# Altium project charcer-wiht-stm32.PrjPcb
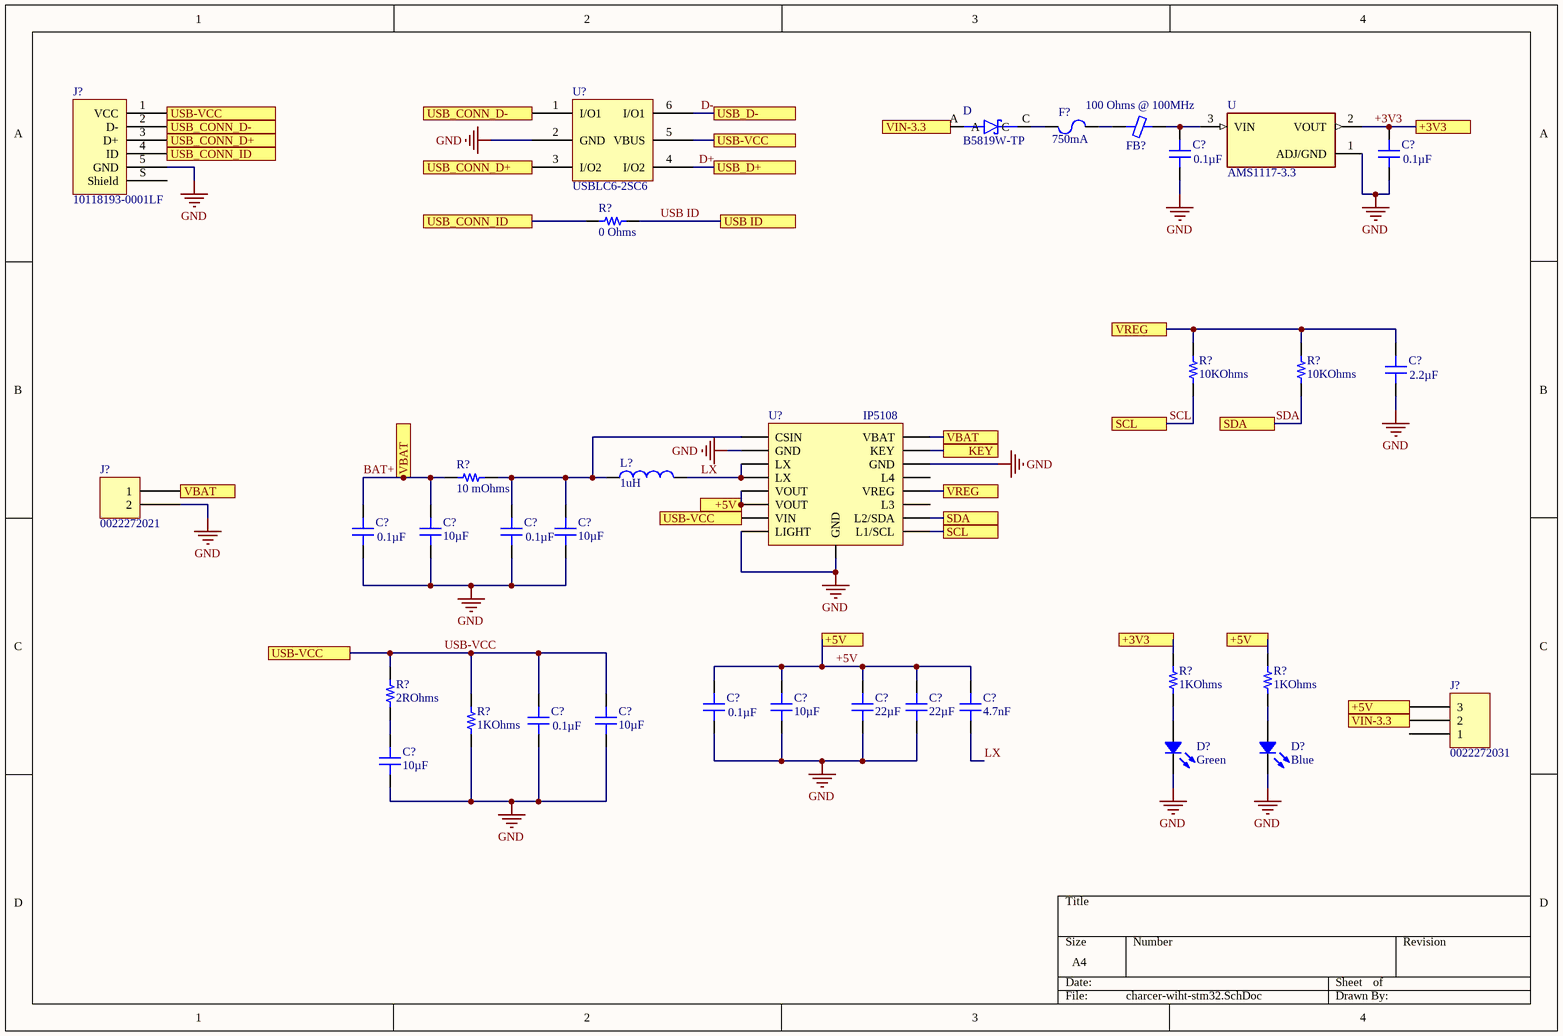
[diagram p0: charcer-wiht-stm32.SchDoc]
3 sheets, 63 parts. Net scope: flat (ports and power ports of the same name join across sheets).
Board file: charcer-wiht-stm32.PcbDoc
Sheets:
  charcer-wiht-stm32.SchDoc
  stm side.SchDoc
  ESP32-WROOM-32D.SchDoc

## Sheet charcer-wiht-stm32.SchDoc
size A4

### Parts
(Parts that share a designator on the sheet are numbered #1, #2 ... from top to bottom, then left to right.)
C?#1  0.1µF  [CAP 0805_2012]
C?#2  0.1µF  [CAP 0805_2012]
C?#3  2.2µF  [CAP 0805_2012]
C?#4  0.1µF  [CAP 0805_2012]
C?#5  10µF  [CAP 0805_2012]
C?#6  0.1µF  [CAP 0805_2012]
C?#7  10µF  [CAP 0805_2012]
C?#8  0.1µF  [CAP 0805_2012]
C?#9  10µF  [CAP 0805_2012]
C?#10  22µF  [CAP 1206_3216 - 1.8MM]
C?#11  22µF  [CAP 1206_3216 - 1.8MM]
C?#12  4.7nF  [CAP 0805_2012]
C?#13  0.1µF  [CAP 0805_2012]
C?#14  10µF  [CAP 0805_2012]
C?#15  10µF  [CAP 0805_2012]
D  B5819W-TP  [SOD3716X135N]
D?#1  Green  [LED 0805_2012 GREEN]
D?#2  Blue  [LED 0805_2012 BLUE]
F?  750mA  [FUSE 1206_3216 0.6MM]
FB?#1  100 Ohms @ 100MHz  [FER 0805_2012]
J?#1  10118193-0001LF  [FCI USB 10118193-0001LF]
J?#2  0022272021  [MOLEX KK 0022272021]
J?#3  0022272031  [MOLEX KK 0022272031]
L?  1uH  [INDM7666X50N]
R?#1  0 Ohms  [RES 0402_1005]
R?#2  10KOhms  [RES 0805_2012]
R?#3  10KOhms  [RES 0805_2012]
R?#4  10 mOhms  [RES 0805_2012]
R?#5  1KOhms  [RES 0805_2012]
R?#6  1KOhms  [RES 0805_2012]
R?#7  2ROhms  [RES 0805_2012]
R?#8  1KOhms  [RES 0805_2012]
U  AMS1117-3.3  [SOT229P700X180-4N]
U?#1  USBLC6-2SC6  [SOT23-6L]
U?#2  IP5108  [SOP-16_150mil]

### Ports
+3V3, +5V, KEY, SCL, SDA, USB ID, USB-VCC, USB_CONN_D+, USB_CONN_D-, USB_CONN_ID, USB_D+, USB_D-, VBAT, VIN-3.3, VREG

### Nets
GND: C?#1.1 C?#2.1 C?#3.1 C?#4.1 C?#5.1 C?#6.1 C?#7.1 C?#8.1 C?#9.1 C?#10.1 C?#11.1 C?#13.1 C?#14.1 C?#15.1 D?#1.2 D?#2.2 J?#1.5(GND) J?#2.2 R?#8.2 U.1(ADJ/GND) U?#1.2(GND) U?#2.2(GND) U?#2.8(LIGHT) U?#2.14(GND) U?#2.17(GND)
+3V3: C?#2.2 R?#5.1 U.2(VOUT) ; port +3V3
+5V: C?#8.2 C?#9.2 C?#10.2 C?#11.2 C?#12.2 J?#3.3 R?#6.1 U?#2.5(VOUT) U?#2.6(VOUT) ; port +5V
BAT+: C?#4.2 C?#5.2 J?#2.1 R?#4.1 U?#2.16(VBAT) ; port VBAT
D+: U?#1.4(I/O2) ; port USB_D+
D-: U?#1.6(I/O1) ; port USB_D-
LX: C?#12.1 L?.1 U?#2.3(LX) U?#2.4(LX)
SCL: R?#2.2 U?#2.9(L1/SCL) ; port SCL
SDA: R?#3.2 U?#2.10(L2/SDA) ; port SDA
USB ID: R?#1.2 ; port USB ID
USB-VCC: C?#13.2 C?#14.2 J?#1.1(VCC) R?#7.1 R?#8.1 U?#1.5(VBUS) U?#2.7(VIN) ; port USB-VCC
NetC?#1_2: C?#1.2 FB?#1.2 U.3(VIN)
NetC?#3_2: C?#3.2 R?#2.1 R?#3.1 U?#2.12(VREG) ; port VREG
NetC?#6_2: C?#6.2 C?#7.2 L?.2 R?#4.2 U?#2.1(CSIN)
NetC?#15_2: C?#15.2 R?#7.2
NetD?#1_1: D?#1.1 R?#5.2
NetD?#2_1: D?#2.1 R?#6.2
NetD_A: D.A J?#3.2 ; port VIN-3.3
NetD_C: D.C F?.1
NetF?_2: F?.2 FB?#1.1
NetJ?#1_2: J?#1.2(D-) U?#1.1(I/O1) ; port USB_CONN_D-
NetJ?#1_3: J?#1.3(D+) U?#1.3(I/O2) ; port USB_CONN_D+
NetJ?#1_4: J?#1.4(ID) R?#1.1 ; port USB_CONN_ID
NetU?#2_15: U?#2.15(KEY) ; port KEY

Not connected (* = marked no-connect by the designer): J?#1 S(Shield); J?#3 1; U?#2 11(L3) 13(L4)

### Library data of the parts
C?#1 C?#2 C?#4 C?#6 C?#8 C?#13 = VJ0805Y104KFAAT: CAP CER 0.1UF 50V X7R 0805; Manufacturer: Vishay Vitramon; Tolerance: ±10%; Part Number: VJ0805Y104KFAAT; Value: 0.1µF; Applications: General Purpose; Capacitance: 0.1µF; ComponentLink1Description: Datasheet; ComponentLink1URL: http://www.vishay.com/docs/45199/vjcommercialseries.pdf; ComponentLink2Description: DigiKey Link; ComponentLink2URL: http://digikey.com/product-detail/en/vishay-vitramon/VJ0805Y104KFAAT/720-1753-1-ND/8324173; Device Package: 0805 (2012 Metric); LastUpdated: 2.9.2020 01:04:40; Lifecycle Status: Active; Minimum Order: 1; Mounting Type: Surface Mount, MLCC; Operating Temperature: -55°C ~ 150°C; Package / Case: 0805 (2012 Metric); Packaging: TapeAndReel; PartId: 3420; Part Status: Active; Price: 0.18; Series: VJ; Size / Dimension: 0.079" L x 0.049" W (2.00mm x 1.25mm); Supplier 1: DigiKey; Supplier Part Number 1: 720-1753-1-ND; Temperature Coefficient: X7R; Thickness (Max): 0.057" (1.45mm); Voltage - Rated: 50V
C?#3 = VJ0805Y104KFAAT: CAP CER 0.1UF 50V X7R 0805; Manufacturer: Vishay Vitramon; Capacitance: 0.1µF; Tolerance: ±10%; Part Number: VJ0805Y104KFAAT; Value: 2.2µF; Applications: General Purpose; ComponentLink1Description: Datasheet; ComponentLink1URL: http://www.vishay.com/docs/45199/vjcommercialseries.pdf; ComponentLink2Description: DigiKey Link; ComponentLink2URL: http://digikey.com/product-detail/en/vishay-vitramon/VJ0805Y104KFAAT/720-1753-1-ND/8324173; Device Package: 0805 (2012 Metric); LastUpdated: 2.9.2020 01:04:40; Lifecycle Status: Active; Minimum Order: 1; Mounting Type: Surface Mount, MLCC; Operating Temperature: -55°C ~ 150°C; Package / Case: 0805 (2012 Metric); Packaging: TapeAndReel; PartId: 3420; Part Status: Active; Price: 0.18; Series: VJ; Size / Dimension: 0.079" L x 0.049" W (2.00mm x 1.25mm); Supplier 1: DigiKey; Supplier Part Number 1: 720-1753-1-ND; Temperature Coefficient: X7R; Thickness (Max): 0.057" (1.45mm); Voltage - Rated: 50V
C?#5 C?#7 C?#9 C?#14 C?#15 = CL21X106KAYNNNE: CAP CER 10UF 25V X6S 0805; Manufacturer: Samsung Electro-Mechanics; Tolerance: ±10%; Part Number: CL21X106KAYNNNE; Value: 10µF; Applications: General Purpose; Capacitance: 10µF; ComponentLink1Description: Datasheet; ComponentLink1URL: http://www.samsungsem.com/kr/support/product-search/mlcc/CL21X106KAYNNNE.jsp; ComponentLink2Description: DigiKey Link; ComponentLink2URL: http://digikey.com/product-detail/en/samsung-electro-mechanics/CL21X106KAYNNNE/1276-6698-1-ND/5961557; Device Package: 0805 (2012 Metric); LastUpdated: 2.9.2020 01:04:38; Lifecycle Status: Active; Minimum Order: 1; Mounting Type: Surface Mount, MLCC; Operating Temperature: -55°C ~ 105°C; Package / Case: 0805 (2012 Metric); Packaging: TapeAndReel; PartId: 4781; Part Status: Active; Price: 0.06; Series: CL; Size / Dimension: 0.079" L x 0.049" W (2.00mm x 1.25mm); Supplier 1: DigiKey; Supplier Part Number 1: 1276-6698-1-ND; Temperature Coefficient: X6S; Thickness (Max): 0.057" (1.45mm); Voltage - Rated: 25V
C?#10 C?#11 = EMK316ABJ226KL-T: CAP CER 22UF 16V X5R 1206; Manufacturer: Taiyo Yuden; Tolerance: ±10%; Part Number: EMK316ABJ226KL-T; Value: 22µF; Applications: General Purpose; Capacitance: 22µF; ComponentLink1Description: Datasheet; ComponentLink1URL: https://www.yuden.co.jp/productdata/catalog/mlcc01_e.pdf; ComponentLink2Description: DigiKey Link; ComponentLink2URL: http://digikey.com/product-detail/en/taiyo-yuden/EMK316ABJ226KL-T/587-5521-1-ND/7067197; Device Package: 1206 (3216 Metric); LastUpdated: 2.9.2020 01:05:31; Lifecycle Status: Active; Minimum Order: 1; Mounting Type: Surface Mount, MLCC; Operating Temperature: -55°C ~ 85°C; Package / Case: 1206 (3216 Metric); Packaging: TapeAndReel; PartId: 21826; Part Status: Active; Price: 0.11; Series: M; Size / Dimension: 0.126" L x 0.063" W (3.20mm x 1.60mm); Supplier 1: DigiKey; Supplier Part Number 1: 587-5521-1-ND; Temperature Coefficient: X5R; Thickness (Max): 0.071" (1.80mm); Voltage - Rated: 16V
C?#12 = CL21X106KAYNNNE: CAP CER 10UF 25V X6S 0805; Manufacturer: Samsung Electro-Mechanics; Capacitance: 10µF; Tolerance: ±10%; Part Number: CL21X106KAYNNNE; Value: 4.7nF; Applications: General Purpose; ComponentLink1Description: Datasheet; ComponentLink1URL: http://www.samsungsem.com/kr/support/product-search/mlcc/CL21X106KAYNNNE.jsp; ComponentLink2Description: DigiKey Link; ComponentLink2URL: http://digikey.com/product-detail/en/samsung-electro-mechanics/CL21X106KAYNNNE/1276-6698-1-ND/5961557; Device Package: 0805 (2012 Metric); LastUpdated: 2.9.2020 01:04:38; Lifecycle Status: Active; Minimum Order: 1; Mounting Type: Surface Mount, MLCC; Operating Temperature: -55°C ~ 105°C; Package / Case: 0805 (2012 Metric); Packaging: TapeAndReel; PartId: 4781; Part Status: Active; Price: 0.06; Series: CL; Size / Dimension: 0.079" L x 0.049" W (2.00mm x 1.25mm); Supplier 1: DigiKey; Supplier Part Number 1: 1276-6698-1-ND; Temperature Coefficient: X6S; Thickness (Max): 0.057" (1.45mm); Voltage - Rated: 25V
D = B5819W-TP: Diode Schottky 20V 1A Surface Mount SOD-123; MF: Micro Commercial; Value: *; MP: B5819W-TP; SnapEDA_Link: https://www.snapeda.com/parts/B5819W-TP/Micro%20Commercial/view-part/214542/?ref=snap; Availability: Unavailable; Package: SOD-123 MCC; Price: None
D?#1 = SM0805UGC: LED GREEN CLEAR 0805 SMD; Manufacturer: Bivar Inc.; Configuration: Standard; Current - Test: 20mA; Lens Color: Colorless; Lens Size: 1.40mm x 1.20mm; Lens Style: Rectangle with Flat Top; Millicandela Rating: 10mcd; Viewing Angle: 130°; Voltage - Forward (Vf) (Typ): 2V; Wavelength - Dominant: 565nm; Wavelength - Peak: 563nm; Part Number: SM0805UGC; Color: Green; ComponentLink1Description: Datasheet; ComponentLink1URL: https://www.bivar.com/Files/Datasheets/SM0805UGC.pdf; ComponentLink2Description: DigiKey Link; ComponentLink2URL: http://digikey.com/product-detail/en/bivar-inc/SM0805UGC/492-1329-1-ND/2408561; Device Package: 0805 (2012 Metric); Height (Max): 1.10mm; LastUpdated: 2.9.2020 01:21:05; Lens Transparency: Clear; Lifecycle Status: Active; Minimum Order: 1; Mounting Type: Surface Mount; Package / Case: 0805 (2012 Metric); Packaging: TapeAndReel; PartId: 247; Part Status: Active; Price: 0.18; Series: -; Size / Dimension: 2.00mm L x 1.20mm W; Supplier 1: DigiKey; Supplier Part Number 1: 492-1329-1-ND; Supplier Device Package: 0805; Value: Green
D?#2 = HSMN-C170: LED BLUE DIFFUSED CHIP SMD; Manufacturer: Broadcom Limited; Configuration: Standard; Current - Test: 20mA; Lens Color: White; Lens Size: 1.40mm x 1.25mm; Lens Style: Rectangle with Flat Top; Millicandela Rating: 35mcd; Viewing Angle: 170°; Voltage - Forward (Vf) (Typ): 3.3V; Wavelength - Dominant: 470nm; Wavelength - Peak: 468nm; Part Number: HSMN-C170; Color: Blue; ComponentLink1Description: Datasheet; ComponentLink1URL: https://docs.broadcom.com/docs/AV02-0592EN; ComponentLink2Description: DigiKey Link; ComponentLink2URL: http://digikey.com/product-detail/en/broadcom-limited/HSMN-C170/516-1437-1-ND/637761; Device Package: 0805 (2012 Metric); Height (Max): 0.80mm; LastUpdated: 2.9.2020 01:20:30; Lens Transparency: Diffused; Lifecycle Status: Active; Minimum Order: 1; Mounting Type: Surface Mount; Package / Case: 0805 (2012 Metric); Packaging: TapeAndReel; PartId: 770; Part Status: Active; Price: 0.28; Series: -; Size / Dimension: 2.00mm L x 1.25mm W; Supplier 1: DigiKey; Supplier Part Number 1: 516-1437-1-ND; Supplier Device Package: Chip LED; Value: Blue
F? = 3413.0114.22: FUSE BOARD MNT 750MA 32VAC 63VDC; Manufacturer: Schurter Inc.; Approval Agency: cURus; Breaking Capacity @ Rated Voltage: 50A; Fuse Type: Board Mount (Cartridge Style Excluded); Melting I²t: 0.05; Response Time: Fast Blow; Voltage Rating - AC: 32V; Voltage Rating - DC: 63V; Part Number: 3413.0114.22; Approvals: cURus; ComponentLink1Description: Datasheet; ComponentLink1URL: http://www.schurterinc.com/bundles/snceschurter/epim/_ProdPool_/newDS/en/typ_USF_1206.pdf; ComponentLink2Description: DigiKey Link; ComponentLink2URL: http://digikey.com/product-detail/en/schurter-inc/3413.0114.22/486-1676-1-ND/2870076; Current Rating (Amps): 750mA; Device Package: 1206 (3216 Metric); LastUpdated: 2.9.2020 01:30:41; Lifecycle Status: Active; Minimum Order: 1; Mounting Type: Surface Mount; Operating Temperature: -55°C ~ 90°C; Package / Case: 1206 (3216 Metric); Packaging: TapeAndReel; Part Status: Active; Price: 0.24; Series: USF 1206; Size / Dimension: 0.126" L x 0.063" W x 0.024" H (3.20mm x 1.60mm x 0.60mm); Supplier 1: DigiKey; Supplier Part Number 1: 486-1676-1-ND
FB?#1 = MH2029-101Y: FERRITE BEAD 100 OHM 0805 1LN; Manufacturer: Bourns Inc.; Current Rating (Max): 2A; DC Resistance (DCR) (Max): 100mOhm; Filter Type: Power, Signal Line; Number of Lines: 1; Part Number: MH2029-101Y; ComponentLink1Description: Datasheet; ComponentLink1URL: https://www.bourns.com/docs/Product-Datasheets/mh.pdf; ComponentLink2Description: DigiKey Link; ComponentLink2URL: http://digikey.com/product-detail/en/bourns-inc/MH2029-101Y/MH2029-101YCT-ND/6100092; Device Package: 0805 (2012 Metric); Height (Max): 0.043" (1.10mm); Impedance @ Frequency: 100 Ohms @ 100MHz; LastUpdated: 2.9.2020 01:18:23; Lifecycle Status: Active; Minimum Order: 1; Mounting Type: Surface Mount; Operating Temperature: -55°C ~ 125°C; Package / Case: 0805 (2012 Metric); Packaging: TapeAndReel; PartId: 1212; Part Status: Active; Price: 0.02; Series: MH; Size / Dimension: 0.079" L x 0.047" W (2.00mm x 1.20mm); Supplier 1: DigiKey; Supplier Part Number 1: MH2029-101YCT-ND; Value: 100 Ohms @ 100MHz
J?#1 = 10118193-0001LF: CONN RCPT USB2.0 MICRO B SMD R/A; Manufacturer: Amphenol ICC (FCI); Connector Type: USB - micro B; Current Rating (Amps): 1.8A per Contact; Gender: Receptacle; Mating Cycles: 10000; Number of Contacts: 5; Number of Ports: 1; Shielding: Shielded; Voltage - Rated: 100VAC; Part Number: 10118193-0001LF; ComponentLink1Description: Datasheet; ComponentLink1URL: https://cdn.amphenol-icc.com/media/wysiwyg/files/documentation/datasheet/inputoutput/io_usb_micro.pdf; ComponentLink2Description: DigiKey Link; ComponentLink2URL: //digikey.com/product-detail/en/amphenol-icc-fci/10118193-0001LF/609-4616-2-ND/2785388; Features: Solder Retention; LastUpdated: 9.12.2019 20:51:28; Lifecycle Status: 0; Minimum Order: 1; Mounting Feature: Horizontal; Mounting Type: Surface Mount, Right Angle; Through Hole; Operating Temperature: -30°C ~ 80°C; Packaging: TapeAndReel; Part Status: Active; Price: 0.21; Series: -; Specifications: USB 2.0; Supplier 1: DigiKey; Supplier Part Number 1: 609-4616-2-ND; Termination: Solder
J?#2 = 0022272021: CONN HEADER VERT 2POS 2.54MM; Manufacturer: Molex; Contact Length - Mating: 0.295" (7.49mm); Contact Length - Post: 0.140" (3.56mm); Material Flammability Rating: UL94 V-0; Number of Positions: 2; Number of Positions Loaded: All; Overall Contact Length: 0.560" (14.22mm); Pitch - Mating: 0.100" (2.54mm); Shrouding: Shrouded - 1 Wall; Style: Board to Cable/Wire; Part Number: 0022272021; ComponentLink1Description: Datasheet; ComponentLink1URL: https://www.molex.com/pdm_docs/sd/022272021_sd.pdf; ComponentLink2Description: DigiKey Link; ComponentLink2URL: http://digikey.com/product-detail/en/molex/0022272021/WM4111-ND/1130577; Connector Type: Header; Contact Finish - Mating: Tin; Contact Finish - Post: Tin; Contact Finish Thickness - Mating: 100.0µin (2.54µm); Contact Material: Brass; Contact Shape: Square; Contact Type: Male Pin; Fastening Type: Friction Lock; Insulation Color: Natural; Insulation Height: 0.461" (11.70mm); Insulation Material: Polyamide (PA), Nylon; LastUpdated: 12.1.2020 23:51:43; Lifecycle Status: Active; Minimum Order: 1; Mounting Type: Through Hole; Number of Rows: 1; Packaging: Bulk; PartId: 76; Part Status: Active; Price: 0.27; Series: KK 6410; Supplier 1: DigiKey; Supplier Part Number 1: WM4111-ND; Termination: Solder
J?#3 = 0022272031: CONN HEADER VERT 3POS 2.54MM; Manufacturer: Molex; Contact Length - Mating: 0.295" (7.49mm); Contact Length - Post: 0.140" (3.56mm); Material Flammability Rating: UL94 V-0; Number of Positions: 3; Number of Positions Loaded: All; Overall Contact Length: 0.560" (14.22mm); Pitch - Mating: 0.100" (2.54mm); Shrouding: Shrouded - 1 Wall; Style: Board to Cable/Wire; Part Number: 0022272031; ComponentLink1Description: Datasheet; ComponentLink1URL: https://www.molex.com/pdm_docs/sd/022272031_sd.pdf; ComponentLink2Description: DigiKey Link; ComponentLink2URL: http://digikey.com/product-detail/en/molex/0022272031/WM4112-ND/1130578; Connector Type: Header; Contact Finish - Mating: Tin; Contact Finish - Post: Tin; Contact Finish Thickness - Mating: 100.0µin (2.54µm); Contact Material: Brass; Contact Shape: Square; Contact Type: Male Pin; Fastening Type: Friction Lock; Insulation Color: Natural; Insulation Height: 0.461" (11.70mm); Insulation Material: Polyamide (PA), Nylon; LastUpdated: 12.1.2020 23:51:54; Lifecycle Status: Active; Minimum Order: 1; Mounting Type: Through Hole; Number of Rows: 1; Packaging: Bulk; PartId: 77; Part Status: Active; Price: 0.37; Series: KK 6410; Supplier 1: DigiKey; Supplier Part Number 1: WM4112-ND; Termination: Solder
L? = SMPI06050-1R0M: Fixed Inductors .1uH 20%; Manufacturer: CORE MASTER; Core Material: Ferrite; DC Resistance (DCR): 7mR; Shielding: Shielded; Inductance: 100nH; Max DC Current: 40A; Test Frequency: 100kHz; Current Rating: 18A; Self Resonant Frequency: 5MHz; Resistance: 3mR; Supplier 1: ozdisan; Manufacturer Part Number: SMPI06050-1R0M; RoHS: Yes; Category: Fixed Inductors; Mount: Surface Mount; Case/Package: NONSTANDARD; Number of Pins: 2; Case Code (Imperial): 2525; Case Code (Metric): 6363; Min Operating Temperature: -55°C; Max Operating Temperature: 125°C; Package Quantity: 2000; Packaging: Tape and Reel; Termination: SMD/SMT; Tolerance: 20%; Saturation Current: 40A; Inductance Tolerance: 20%; RMS Current (Irms): 18A; Length: 6.86mm; Width: 0.255inch; Height: 1.8mm; Height - Seated (Max): 0.071inch; Depth: 6.72mm; Radiation Hardening: No; Lead Free: Lead Free; REACH SVHC: Unknown; ComponentLink1URL: https://datasheet.ciiva.com/11798/0900766b8102c932-11798378.pdf?src-supplier=RSComponents; ComponentLink1Description: https://datasheet.ciiva.com/11798/0900766b8102c932-11798378.pdf?src-supplier=RSComponents; ComponentLink2URL: https://datasheet.ciiva.com/1076/ih25ah01-1076900.pdf?src-supplier=Digi-Key; ComponentLink2Description: https://datasheet.ciiva.com/1076/ih25ah01-1076900.pdf?src-supplier=Digi-Key; ComponentLink3URL: https://datasheet.ciiva.com/8017/425589-8017240.pdf?src-supplier=Element14; ComponentLink3Description: https://datasheet.ciiva.com/8017/425589-8017240.pdf?src-supplier=Element14; ComponentLink4URL: https://datasheet.ciiva.com/17269/ih25ah01-17269371.pdf?src-supplier=Avnet+Europe; ComponentLink4Description: https://datasheet.ciiva.com/17269/ih25ah01-17269371.pdf?src-supplier=Avnet+Europe; ComponentLink5URL: https://datasheet.ciiva.com/16460/ih25ah01-16460077.pdf?src-supplier=Future+Electronics; ComponentLink5Description: https://datasheet.ciiva.com/16460/ih25ah01-16460077.pdf?src-supplier=Future+Electronics; ComponentLink6URL: https://datasheet.ciiva.com/8496/ih25ah01-8496206.pdf?src-supplier=Avnet; ComponentLink6Description: https://datasheet.ciiva.com/8496/ih25ah01-8496206.pdf?src-supplier=Avnet; Stock 1: 2000; Supplier Part Number 1: SMPI06050-1R0M
R?#1 = CRCW04020000Z0EDHP: RES SMD 0 OHM JUMPER 1/5W 0402; Manufacturer: Vishay Dale; Power (Watts): 0.2W, 1/5W; Part Number: CRCW04020000Z0EDHP; Value: 0 Ohms; ComponentLink1Description: Datasheet; ComponentLink1URL: http://www.vishay.com/docs/20043/crcwhpe3.pdf; ComponentLink2Description: DigiKey Link; ComponentLink2URL: http://digikey.com/product-detail/en/vishay-dale/CRCW04020000Z0EDHP/541-0.0YBCT-ND/2223008; Composition: Thick Film; Device Package: 0402 (1005 Metric); Features: Automotive AEC-Q200, Pulse Withstanding; Height - Seated (Max): 0.016" (0.40mm); LastUpdated: 2.9.2020 01:08:09; Lifecycle Status: Active; Minimum Order: 1; Number of Terminations: 2; Operating Temperature: -55°C ~ 155°C; Package / Case: 0402 (1005 Metric); Packaging: TapeAndReel; PartId: 3131; Part Status: Active; Price: 0.01; Ratings: AEC-Q200; Resistance: 0 Ohms; Series: CRCW-HP; Size / Dimension: 0.039" L x 0.020" W (1.00mm x 0.50mm); Supplier 1: DigiKey; Supplier Part Number 1: 541-0.0YBCT-ND; Supplier Device Package: 0402; Tolerance: Jumper
R?#2 R?#3 R?#5-R?#8 = RL0805FR-070R01L: RES 0.01 OHM 1% 1/8W 0805; Manufacturer: Yageo; Power (Watts): 0.125W, 1/8W; Resistance: 10 mOhms; Temperature Coefficient: ±1500ppm/°C; Part Number: RL0805FR-070R01L; ComponentLink1Description: Datasheet; ComponentLink1URL: http://www.yageo.com/documents/recent/PYu-RL_Group_521_RoHS_L_2.pdf; ComponentLink2Description: DigiKey Link; ComponentLink2URL: http://digikey.com/product-detail/en/yageo/RL0805FR-070R01L/311-0.01SCT-ND/2827993; Composition: Thick Film; Device Package: 0805 (2012 Metric); Features: Automotive AEC-Q200, Current Sense, Moisture Resistant; Height - Seated (Max): 0.024" (0.60mm); LastUpdated: 2.9.2020 01:15:18; Lifecycle Status: Active; Minimum Order: 1; Number of Terminations: 2; Operating Temperature: -55°C ~ 155°C; Package / Case: 0805 (2012 Metric); Packaging: TapeAndReel; PartId: 30376; Part Status: Active; Price: 0.09; Ratings: AEC-Q200; Series: RL; Size / Dimension: 0.079" L x 0.049" W (2.00mm x 1.25mm); Supplier 1: DigiKey; Supplier Part Number 1: 311-0.01SCT-ND; Supplier Device Package: 0805; Tolerance: ±1%
  R?#2 R?#3: Value: 10KOhms
  R?#5 R?#6 R?#8: Value: 1KOhms
  R?#7: Value: 2ROhms
R?#4 = RL0805FR-070R01L: RES 0.01 OHM 1% 1/8W 0805; Manufacturer: Yageo; Power (Watts): 0.125W, 1/8W; Temperature Coefficient: ±1500ppm/°C; Part Number: RL0805FR-070R01L; Value: 10 mOhms; ComponentLink1Description: Datasheet; ComponentLink1URL: http://www.yageo.com/documents/recent/PYu-RL_Group_521_RoHS_L_2.pdf; ComponentLink2Description: DigiKey Link; ComponentLink2URL: http://digikey.com/product-detail/en/yageo/RL0805FR-070R01L/311-0.01SCT-ND/2827993; Composition: Thick Film; Device Package: 0805 (2012 Metric); Features: Automotive AEC-Q200, Current Sense, Moisture Resistant; Height - Seated (Max): 0.024" (0.60mm); LastUpdated: 2.9.2020 01:15:18; Lifecycle Status: Active; Minimum Order: 1; Number of Terminations: 2; Operating Temperature: -55°C ~ 155°C; Package / Case: 0805 (2012 Metric); Packaging: TapeAndReel; PartId: 30376; Part Status: Active; Price: 0.09; Ratings: AEC-Q200; Resistance: 10 mOhms; Series: RL; Size / Dimension: 0.079" L x 0.049" W (2.00mm x 1.25mm); Supplier 1: DigiKey; Supplier Part Number 1: 311-0.01SCT-ND; Supplier Device Package: 0805; Tolerance: ±1%
U = AMS1117-3.3: Sot223/Pkg 1-Amp 3.3-Volt Low Drop Out Voltage Regulatator; MF: Advanced Monolithic Systems; Price: None; Package: None; Value: *; MP: AMS1117-3.3; Availability: Unavailable; SnapEDA_Link: https://www.snapeda.com/parts/AMS1117-3.3/Advanced%20Monolithic%20Systems/view-part/53450/?ref=snap
U?#1 = USBLC6-2SC6: USBLC6 Series 4 Line 6 V Uni / Bi-Directional ESD Protection - SOT-23-6; Manufacturer: STMicroelectronics; Capacitance: 4pF; Direction: Unidirectional; Clamping Voltage: 17V; Number of Bidirectional Channels: 4; Reverse Standoff Voltage: 5V; Min Breakdown Voltage: 6V; Power Line Protection: Yes; Leakage Current: 150nA; Peak Pulse Current: 5A; Operating Supply Voltage: 860mV; Test Current: 1mA; Max Reverse Leakage Current: 2uA; Number of Elements: 1; Polarity: Unidirectional,Bidirectional; Max Breakdown Voltage: 10V; Supplier 1: Avnet; Manufacturer Part Number: USBLC6-2SC6; RoHS: Yes; Category: ESD and Circuit Protection ICs; Stock 1: 147000; Pricing 1: 3000=0,24113, 6000=0,23936, 12000=0,23732, 18000=0,23404, 24000=0,23049, 30000=0,22872, 300000=0,22694 (USD); Mount: Surface Mount; Case/Package: SOT-23; Number of Pins: 6; Contact Plating: Tin,Matte; Weight: 0.01lb; Min Operating Temperature: -40°C; Max Operating Temperature: 125°C; Package Quantity: 3000; Packaging: Tape and Reel; Number of Channels: 4; Breakdown Voltage: 6V; Termination: SMD/SMT; ESD Protection: Yes; Reverse Breakdown Voltage: 6V; Working Voltage: 5V; Voltage Rating (DC): 5V; Length: 3mm; Width: 1.75mm; Height: 1.3mm; Depth: 1.75mm; Radiation Hardening: No; Lead Free: Lead Free; REACH SVHC: No SVHC; ComponentLink1URL: https://datasheet.ciiva.com/16206/cd00047494-16206119.pdf?src-supplier=Future+Electronics; ComponentLink1Description: https://datasheet.ciiva.com/16206/cd00047494-16206119.pdf?src-supplier=Future+Electronics; ComponentLink2URL: https://datasheet.ciiva.com/14186/usblc6-4-st-eng-tds-14186570.pdf?src-supplier=Distrelec; ComponentLink2Description: https://datasheet.ciiva.com/14186/usblc6-4-st-eng-tds-14186570.pdf?src-supplier=Distrelec; ComponentLink3URL: https://datasheet.ciiva.com/4507/cd00047494-112581-4507757.pdf?src-supplier=Mouser; ComponentLink3Description: https://datasheet.ciiva.com/4507/cd00047494-112581-4507757.pdf?src-supplier=Mouser; ComponentLink4URL: https://datasheet.ciiva.com/27052/1493951-27052291.pdf?src-supplier=Jameco; ComponentLink4Description: https://datasheet.ciiva.com/27052/1493951-27052291.pdf?src-supplier=Jameco; ComponentLink5URL: https://datasheet.ciiva.com/15143/getdatasheetpartid-88767-15143364.pdf?src-supplier=Verical; ComponentLink5Description: https://datasheet.ciiva.com/15143/getdatasheetpartid-88767-15143364.pdf?src-supplier=Verical; ComponentLink6URL: https://datasheet.ciiva.com/1220/48344-1220005.pdf?src-supplier=Newark; ComponentLink6Description: https://datasheet.ciiva.com/1220/48344-1220005.pdf?src-supplier=Newark; ComponentLink7URL: https://datasheet.ciiva.com/26787/usblc6-4sc6-26787917.pdf?src-supplier=IIIC; ComponentLink7Description: https://datasheet.ciiva.com/26787/usblc6-4sc6-26787917.pdf?src-supplier=IIIC; ComponentLink8URL: https://datasheet.ciiva.com/22692/1498406-22692454.pdf?src-supplier=Element14; ComponentLink8Description: https://datasheet.ciiva.com/22692/1498406-22692454.pdf?src-supplier=Element14; ComponentLink9URL: https://datasheet.ciiva.com/22685/1498406-22685833.pdf?src-supplier=Element14; ComponentLink9Description: https://datasheet.ciiva.com/22685/1498406-22685833.pdf?src-supplier=Element14; Supplier Part Number 1: USBLC6-2SC6
U?#2 = IP5108: SOP-16_150mil PMIC - Battery Management RoHS; Manufacturer: INJOINIC; ComponentLink3Description: LCSC LINK; ComponentLink3URL: https://lcsc.com/product-detail/PMIC-Battery-Management_INJOINIC-IP5108_C180943.html; ComponentLink4Description: Datasheet; ComponentLink4URL: http://www.injoinic.com/wwwroot/uploads/files/20200221/5edb08a79152c9ee2ca8ea29a5d5ad25.pdf; Category: Battery Management; Package: SOP-16_150mil; RoHS: YES; LCSC Part #: C180943; Mfr.Part #: IP5108

## Sheet stm side.SchDoc
size A4
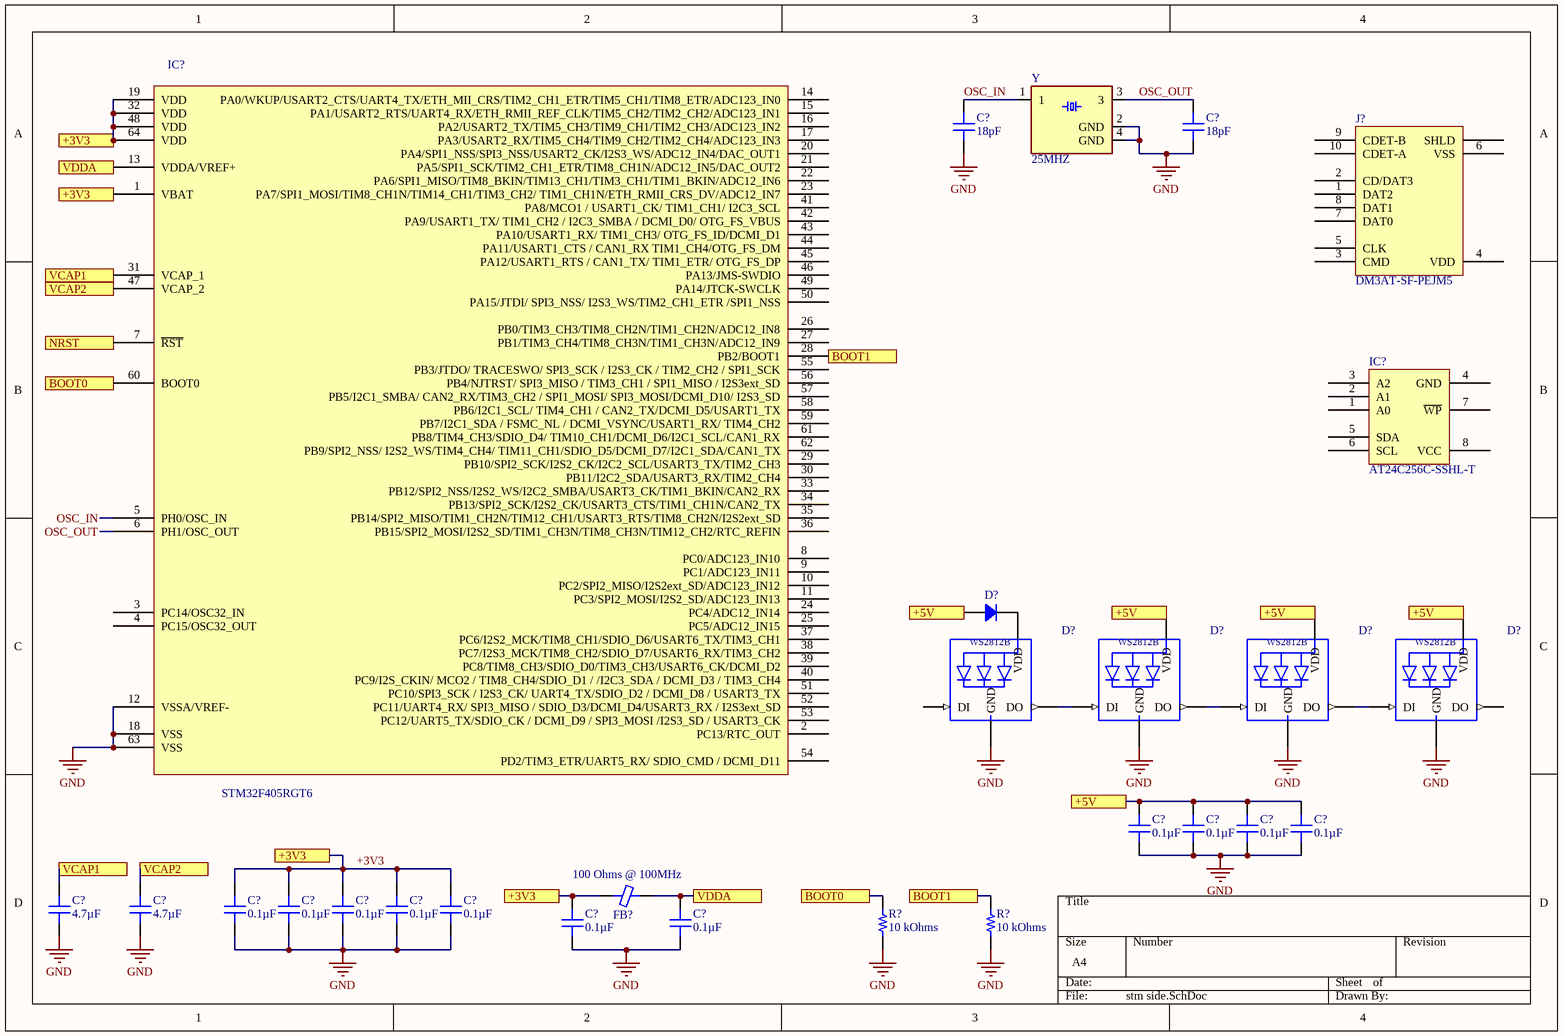
[diagram p1: stm side.SchDoc]

### Parts
(Parts that share a designator on the sheet are numbered #1, #2 ... from top to bottom, then left to right.)
C?#16  18pF  [CAP 0603_1608]
C?#17  18pF  [CAP 0603_1608]
C?#18  0.1µF  [CAP 0805_2012]
C?#19  0.1µF  [CAP 0805_2012]
C?#20  0.1µF  [CAP 0805_2012]
C?#21  0.1µF  [CAP 0805_2012]
C?#22  4.7µF  [CAP 0805_2012]
C?#23  4.7µF  [CAP 0805_2012]
C?#24  0.1µF  [CAP 0805_2012]
C?#25  0.1µF  [CAP 0805_2012]
C?#26  0.1µF  [CAP 0805_2012]
C?#27  0.1µF  [CAP 0805_2012]
C?#28  0.1µF  [CAP 0805_2012]
C?#29  0.1µF  [CAP 0805_2012]
C?#30  0.1µF  [CAP 0805_2012]
D?#3  SMLJ60S05-TP  [DO214AB SMC]  (value not drawn)
D?#4  WS2812B  [WS2812B]  (value not drawn)
D?#5  WS2812B  [WS2812B]  (value not drawn)
D?#6  WS2812B  [WS2812B]  (value not drawn)
D?#7  WS2812B  [WS2812B]  (value not drawn)
FB?#2  100 Ohms @ 100MHz  [FER 0805_2012]
IC?#1  AT24C256C-SSHL-T  [MICROCHIP SOIC-8 150MIL WIDE]
IC?#2  STM32F405RGT6  [ST LQFP-64 10X10MM]
J?#4  DM3AT-SF-PEJM5  [HIROSE DM3AT-SF-PEJM5]
R?#9  10 kOhms  [RES 0805_2012]
R?#10  10 kOhms  [RES 0805_2012]
Y  25MHZ  [OSCSC320X250X100N]

### Ports
+3V3, +5V, BOOT0, BOOT1, NRST, VCAP1, VCAP2, VDDA

### Nets
GND: C?#16.1 C?#17.1 C?#18.2 C?#19.2 C?#20.2 C?#21.2 C?#22.2 C?#23.2 C?#24.2 C?#25.2 C?#26.2 C?#27.2 C?#28.2 C?#29.2 C?#30.2 D?#4.3-GND(GND) D?#5.3-GND(GND) D?#6.3-GND(GND) D?#7.3-GND(GND) IC?#2.12(VSSA/VREF-) IC?#2.18(VSS) IC?#2.63(VSS) R?#9.2 R?#10.2 Y.2(GND) Y.4(GND)
+3V3: C?#24.1 C?#25.1 C?#26.1 C?#27.1 C?#28.1 C?#29.1 FB?#2.1 IC?#2.1(VBAT) IC?#2.19(VDD) IC?#2.32(VDD) IC?#2.48(VDD) IC?#2.64(VDD) ; port +3V3
+5V: C?#18.1 C?#19.1 C?#20.1 C?#21.1 D?#3.1 D?#5.1-VDD(VDD) D?#6.1-VDD(VDD) D?#7.1-VDD(VDD) ; port +5V
OSC_IN: C?#16.2 IC?#2.5(PH0/OSC_IN) Y.1
OSC_OUT: C?#17.2 IC?#2.6(PH1/OSC_OUT) Y.3
NetC?#22_1: C?#22.1 IC?#2.31(VCAP_1) ; port VCAP1
NetC?#23_1: C?#23.1 IC?#2.47(VCAP_2) ; port VCAP2
NetC?#30_1: C?#30.1 FB?#2.2 IC?#2.13(VDDA/VREF+) ; port VDDA
NetD?#3_2: D?#3.2 D?#4.1-VDD(VDD)
NetD?#4_2-DOUT: D?#4.2-DOUT(DO) D?#5.4-DIN(DI)
NetD?#5_2-DOUT: D?#5.2-DOUT(DO) D?#6.4-DIN(DI)
NetD?#6_2-DOUT: D?#6.2-DOUT(DO) D?#7.4-DIN(DI)
NetIC?#2_7: IC?#2.7(~{RST}) ; port NRST
NetIC?#2_28: IC?#2.28(PB2/BOOT1) R?#10.1 ; port BOOT1
NetIC?#2_60: IC?#2.60(BOOT0) R?#9.1 ; port BOOT0

Not connected (* = marked no-connect by the designer): D?#4 4-DIN(DI); D?#7 2-DOUT(DO); IC?#1 1(A0) 2(A1) 3(A2) 4(GND) 5(SDA) 6(SCL) 7(~{WP}) 8(VCC); IC?#2 2(PC13/RTC_OUT) 3(PC14/OSC32_IN) 4(PC15/OSC32_OUT) 8(PC0/ADC123_IN10) 9(PC1/ADC123_IN11) 10(PC2/SPI2_MISO/I2S2ext_SD/ADC123_IN12) 11(PC3/SPI2_MOSI/I2S2_SD/ADC123_IN13) 14(PA0/WKUP/USART2_CTS/UART4_TX/ETH_MII_CRS/TIM2_CH1_ETR/TIM5_CH1/TIM8_ETR/ADC123_IN0) 15(PA1/USART2_RTS/UART4_RX/ETH_RMII_REF_CLK/TIM5_CH2/TIM2_CH2/ADC123_IN1) 16(PA2/USART2_TX/TIM5_CH3/TIM9_CH1/TIM2_CH3/ADC123_IN2) 17(PA3/USART2_RX/TIM5_CH4/TIM9_CH2/TIM2_CH4/ADC123_IN3) 20(PA4/SPI1_NSS/SPI3_NSS/USART2_CK/I2S3_WS/ADC12_IN4/DAC_OUT1) 21(PA5/SPI1_SCK/TIM2_CH1_ETR/TIM8_CH1N/ADC12_IN5/DAC_OUT2) 22(PA6/SPI1_MISO/TIM8_BKIN/TIM13_CH1/TIM3_CH1/TIM1_BKIN/ADC12_IN6) 23(PA7/SPI1_MOSI/TIM8_CH1N/TIM14_CH1/TIM3_CH2/_TIM1_CH1N/ETH_RMII_CRS_DV/ADC12_IN7) 24(PC4/ADC12_IN14) 25(PC5/ADC12_IN15) 26(PB0/TIM3_CH3/TIM8_CH2N/TIM1_CH2N/ADC12_IN8) 27(PB1/TIM3_CH4/TIM8_CH3N/TIM1_CH3N/ADC12_IN9) 29(PB10/SPI2_SCK/I2S2_CK/I2C2_SCL/USART3_TX/TIM2_CH3) 30(PB11/I2C2_SDA/USART3_RX/TIM2_CH4) 33(PB12/SPI2_NSS/I2S2_WS/I2C2_SMBA/USART3_CK/TIM1_BKIN/CAN2_RX) 34(PB13/SPI2_SCK/I2S2_CK/USART3_CTS/TIM1_CH1N/CAN2_TX) 35(PB14/SPI2_MISO/TIM1_CH2N/TIM12_CH1/USART3_RTS/TIM8_CH2N/I2S2ext_SD) 36(PB15/SPI2_MOSI/I2S2_SD/TIM1_CH3N/TIM8_CH3N/TIM12_CH2/RTC_REFIN) 37(PC6/I2S2_MCK/TIM8_CH1/SDIO_D6/USART6_TX/TIM3_CH1) 38(PC7/I2S3_MCK/TIM8_CH2/SDIO_D7/USART6_RX/TIM3_CH2) 39(PC8/TIM8_CH3/SDIO_D0/TIM3_CH3/USART6_CK/DCMI_D2) 40(PC9/I2S_CKIN/_MCO2_/_TIM8_CH4/SDIO_D1_/_/I2C3_SDA_/_DCMI_D3_/_TIM3_CH4) 41(PA8/MCO1_/_USART1_CK/_TIM1_CH1/_I2C3_SCL) 42(PA9/USART1_TX/_TIM1_CH2_/_I2C3_SMBA_/_DCMI_D0/_OTG_FS_VBUS) 43(PA10/USART1_RX/_TIM1_CH3/_OTG_FS_ID/DCMI_D1) 44(PA11/USART1_CTS_/_CAN1_RX_TIM1_CH4/OTG_FS_DM) 45(PA12/USART1_RTS_/_CAN1_TX/_TIM1_ETR/_OTG_FS_DP) 46(PA13/JMS-SWDIO) 49(PA14/JTCK-SWCLK) 50(PA15/JTDI/_SPI3_NSS/_I2S3_WS/TIM2_CH1_ETR_/SPI1_NSS) 51(PC10/SPI3_SCK_/_I2S3_CK/_UART4_TX/SDIO_D2_/_DCMI_D8_/_USART3_TX) 52(PC11/UART4_RX/_SPI3_MISO_/_SDIO_D3/DCMI_D4/USART3_RX_/_I2S3ext_SD) 53(PC12/UART5_TX/SDIO_CK_/_DCMI_D9_/_SPI3_MOSI_/I2S3_SD_/_USART3_CK) 54(PD2/TIM3_ETR/UART5_RX/_SDIO_CMD_/_DCMI_D11) 55(PB3/JTDO/_TRACESWO/_SPI3_SCK_/_I2S3_CK_/_TIM2_CH2_/_SPI1_SCK) 56(PB4/NJTRST/_SPI3_MISO_/_TIM3_CH1_/_SPI1_MISO_/_I2S3ext_SD) 57(PB5/I2C1_SMBA/_CAN2_RX/TIM3_CH2_/_SPI1_MOSI/_SPI3_MOSI/DCMI_D10/_I2S3_SD) 58(PB6/I2C1_SCL/_TIM4_CH1_/_CAN2_TX/DCMI_D5/USART1_TX) 59(PB7/I2C1_SDA_/_FSMC_NL_/_DCMI_VSYNC/USART1_RX/_TIM4_CH2) 61(PB8/TIM4_CH3/SDIO_D4/_TIM10_CH1/DCMI_D6/I2C1_SCL/CAN1_RX) 62(PB9/SPI2_NSS/_I2S2_WS/TIM4_CH4/_TIM11_CH1/SDIO_D5/DCMI_D7/I2C1_SDA/CAN1_TX); J?#4 1(DAT2) 2(CD/DAT3) 3(CMD) 4(VDD) 5(CLK) 6(VSS) 7(DAT0) 8(DAT1) 9(CDET-B) 10(CDET-A) S(SHLD)

### Library data of the parts
C?#16 C?#17 = VJ0603A180FXJCW1BC: CAP CER 18PF 16V C0G/NP0 0603; Manufacturer: Vishay Vitramon; Temperature Coefficient: C0G, NP0; Tolerance: ±1%; Part Number: VJ0603A180FXJCW1BC; Value: 18pF; Applications: General Purpose; Capacitance: 18pF; ComponentLink1Description: Datasheet; ComponentLink1URL: https://www.vishay.com/docs/28548/vjw1bcbascomseries.pdf; ComponentLink2Description: DigiKey Link; ComponentLink2URL: http://digikey.com/product-detail/en/vishay-vitramon/VJ0603A180FXJCW1BC/720-1659-1-ND/8324079; Device Package: 0603 (1608 Metric); LastUpdated: 2.9.2020 01:03:27; Lifecycle Status: Active; Minimum Order: 1; Mounting Type: Surface Mount, MLCC; Operating Temperature: -55°C ~ 125°C; Package / Case: 0603 (1608 Metric); Packaging: TapeAndReel; PartId: 7092; Part Status: Active; Price: 0.04; Series: VJ; Size / Dimension: 0.063" L x 0.031" W (1.60mm x 0.80mm); Supplier 1: DigiKey; Supplier Part Number 1: 720-1659-1-ND; Thickness (Max): 0.034" (0.87mm); Voltage - Rated: 16V
C?#18-C?#21 C?#24-C?#30 = 08053D475MAT2A: CAP CER 4.7UF 25V X5R 0805; Manufacturer: AVX Corporation; Capacitance: 4.7µF; Tolerance: ±20%; Part Number: 08053D475MAT2A; Value: 0.1µF; Applications: General Purpose; ComponentLink1Description: Datasheet; ComponentLink1URL: http://datasheets.avx.com/cx5r.pdf; ComponentLink2Description: DigiKey Link; ComponentLink2URL: http://digikey.com/product-detail/en/avx-corporation/08053D475MAT2A/478-5321-1-ND/1950988; Device Package: 0805 (2012 Metric); LastUpdated: 2.9.2020 01:04:37; Lifecycle Status: Active; Minimum Order: 1; Mounting Type: Surface Mount, MLCC; Operating Temperature: -55°C ~ 85°C; Package / Case: 0805 (2012 Metric); Packaging: TapeAndReel; PartId: 5116; Part Status: Active; Price: 0.14; Series: -; Size / Dimension: 0.079" L x 0.049" W (2.01mm x 1.25mm); Supplier 1: DigiKey; Supplier Part Number 1: 478-5321-1-ND; Temperature Coefficient: X5R; Thickness (Max): 0.055" (1.40mm); Voltage - Rated: 25V
C?#22 C?#23 = 08053D475MAT2A: CAP CER 4.7UF 25V X5R 0805; Manufacturer: AVX Corporation; Tolerance: ±20%; Part Number: 08053D475MAT2A; Value: 4.7µF; Applications: General Purpose; Capacitance: 4.7µF; ComponentLink1Description: Datasheet; ComponentLink1URL: http://datasheets.avx.com/cx5r.pdf; ComponentLink2Description: DigiKey Link; ComponentLink2URL: http://digikey.com/product-detail/en/avx-corporation/08053D475MAT2A/478-5321-1-ND/1950988; Device Package: 0805 (2012 Metric); LastUpdated: 2.9.2020 01:04:37; Lifecycle Status: Active; Minimum Order: 1; Mounting Type: Surface Mount, MLCC; Operating Temperature: -55°C ~ 85°C; Package / Case: 0805 (2012 Metric); Packaging: TapeAndReel; PartId: 5116; Part Status: Active; Price: 0.14; Series: -; Size / Dimension: 0.079" L x 0.049" W (2.01mm x 1.25mm); Supplier 1: DigiKey; Supplier Part Number 1: 478-5321-1-ND; Temperature Coefficient: X5R; Thickness (Max): 0.055" (1.40mm); Voltage - Rated: 25V
D?#3 = SMLJ60S05-TP: DIODE GEN PURP 50V 6A DO214AB; Manufacturer: Micro Commercial Co; Capacitance @ Vr, F: 150pF @ 4V, 1MHz; Current - Reverse Leakage @ Vr: 5µA @ 50V; Diode Type: Standard; Speed: Standard Recovery >500ns, > 200mA (Io); Voltage - Forward (Vf) (Max) @ If: 1V @ 6A; Part Number: SMLJ60S05-TP; ComponentLink1Description: Datasheet; ComponentLink1URL: https://www.mccsemi.com/pdf/Products/SMLJ60S05~SMLJ60S10(DO-214AB).pdf; ComponentLink2Description: DigiKey Link; ComponentLink2URL: http://digikey.com/product-detail/en/micro-commercial-co/SMLJ60S05-TP/SMLJ60S05-TPMSCT-ND/2404599; Current - Average Rectified (Io): 6A; LastUpdated: 2.9.2020 01:18:57; Lifecycle Status: Active; Minimum Order: 1; Mounting Type: Surface Mount; Operating Temperature - Junction: -55°C ~ 150°C; Package / Case: DO-214AB, SMC; Packaging: TapeAndReel; PartId: 345; Part Status: Active; Price: 0.40; Series: -; Supplier 1: DigiKey; Supplier Part Number 1: SMLJ60S05-TPMSCT-ND; Supplier Device Package: DO-214AB (SMC); Voltage - DC Reverse (Vr) (Max): 50V
D?#4-D?#7 = WS2812B: Raspberry Pi HAT _40 pin_ Wheeled Robotics Kit; MF: SparkFun Electronics; Availability: Unavailable; SnapEDA_Link: https://www.snapeda.com/parts/WS2812B/Worldsemi/view-part/1038297/?ref=snap; MP: WS2812B; Price: None; Value: *; Package: None
FB?#2 = MH2029-101Y: as FB?#1 on sheet charcer-wiht-stm32; Part Number: MH2029-101Y; ComponentLink1Description: Datasheet; ComponentLink1URL: https://www.bourns.com/docs/Product-Datasheets/mh.pdf; ComponentLink2Description: DigiKey Link; ComponentLink2URL: http://digikey.com/product-detail/en/bourns-inc/MH2029-101Y/MH2029-101YCT-ND/6100092; Device Package: 0805 (2012 Metric); Height (Max): 0.043" (1.10mm); Impedance @ Frequency: 100 Ohms @ 100MHz; LastUpdated: 2.9.2020 01:18:23; Lifecycle Status: Active; Minimum Order: 1; Mounting Type: Surface Mount; Operating Temperature: -55°C ~ 125°C; Package / Case: 0805 (2012 Metric); Packaging: TapeAndReel; PartId: 1212; Part Status: Active; Price: 0.02; Series: MH; Size / Dimension: 0.079" L x 0.047" W (2.00mm x 1.20mm); Supplier 1: DigiKey; Supplier Part Number 1: MH2029-101YCT-ND; Value: 100 Ohms @ 100MHz
IC?#1 = AT24C256C-SSHL-T: IC EEPROM 256K I2C 1MHZ 8SOIC; Manufacturer: Microchip Technology; Access Time: 550ns; Memory Interface: I²C; Memory Size: 256Kb (32K x 8); Memory Type: Non-Volatile; Voltage - Supply: 1.7V ~ 5.5V; Write Cycle Time - Word, Page: 5ms; Part Number: AT24C256C-SSHL-T; Clock Frequency: 1MHz; ComponentLink1Description: Datasheet; ComponentLink1URL: http://www.microchip.com/mymicrochip/filehandler.aspx?ddocname=en590396; ComponentLink2Description: DigiKey Link; ComponentLink2URL: http://digikey.com/product-detail/en/microchip-technology/AT24C256C-SSHL-T/AT24C256C-SSHL-TCT-ND/3178468; LastUpdated: 2.9.2020 01:23:03; Lifecycle Status: Active; Memory Format: EEPROM; Minimum Order: 1; Mounting Type: Surface Mount; Operating Temperature: -40°C ~ 85°C (TA); Package / Case: 8-SOIC (0.154", 3.90mm Width); Packaging: TapeAndReel; PartId: 1099; Part Status: Active; Price: 0.56; Series: -; Supplier 1: DigiKey; Supplier Part Number 1: AT24C256C-SSHL-TCT-ND; Supplier Device Package: 8-SOIC; Technology: EEPROM
IC?#2 = STM32F405RGT6: IC MCU 32BIT 1MB FLASH 64LQFP; Manufacturer: STMicroelectronics; Connectivity: CANbus, I²C, IrDA, LINbus, SPI, UART/USART, USB OTG; Core Processor: ARM® Cortex®-M4; Core Size: 32-Bit; Data Converters: A/D 16x12b; D/A 2x12b; Number of I/O: 51; Oscillator Type: Internal; Peripherals: Brown-out Detect/Reset, DMA, I²S, LCD, POR, PWM, WDT; Program Memory Size: 1MB (1M x 8); RAM Size: 192K x 8; Speed: 168MHz; Voltage - Supply (Vcc/Vdd): 1.8V ~ 3.6V; Part Number: STM32F405RGT6; ComponentLink1Description: Datasheet; ComponentLink1URL: http://www.st.com/content/ccc/resource/technical/document/datasheet/ef/92/76/6d/bb/c2/4f/f7/DM00037051.pdf/files/DM00037051.pdf/jcr:content/translations/en.DM00037051.pdf; ComponentLink2Description: DigiKey Link; ComponentLink2URL: //digikey.com/product-detail/en/stmicroelectronics/STM32F405RGT6/497-11767-ND/2754208; Device Package: 64-LQFP; LastUpdated: 5.12.2019 23:44:20; Lifecycle Status: 0; Minimum Order: 1; Mounting Type: Surface Mount; Operating Temperature: -40°C ~ 85°C (TA); Package / Case: 64-LQFP; Packaging: Tray; PartId: 115; Part Status: Active; Price: 10.30; Program Memory Type: FLASH; Series: STM32F4; Supplier 1: DigiKey; Supplier Part Number 1: 497-11767-ND; Supplier Device Package: 64-LQFP (10x10)
J?#4 = DM3AT-SF-PEJM5: CONN MICRO SD CARD PUSH-PUSH R/A; Manufacturer: Hirose Electric Co Ltd; Card Type: Secure Digital - microSD™; Connector Type: Connector and Ejector; Insertion, Removal Method: Push In, Push Out; Number of Positions: 10 (8 + 2); Part Number: DM3AT-SF-PEJM5; ComponentLink1Description: Datasheet; ComponentLink1URL: https://www.hirose.com/product/document?clcode=CL0609-0033-6-00&productname=DM3AT-SF-PEJ2M5&series=DM3&documenttype=Catalog&lang=en&documentid=D49662_en; ComponentLink2Description: DigiKey Link; ComponentLink2URL: //digikey.com/product-detail/en/hirose-electric-co-ltd/DM3AT-SF-PEJM5/HR1964TR-ND/2533565; Contact Finish: Gold; Features: Switch; Height Above Board: 0.066" (1.68mm); LastUpdated: 16.12.2019 20:34:40; Lifecycle Status: 0; Minimum Order: 1; Mounting Feature: Normal, Standard - Top; Mounting Type: Surface Mount, Right Angle; Packaging: TapeAndReel; Part Status: Active; Price: 1.41; Series: DM3; Supplier 1: DigiKey; Supplier Part Number 1: HR1964TR-ND
R?#9 R?#10 = CRS0805-FX-1002ELF: RES SMD 10K OHM 1% 1/4W 0805; Manufacturer: Bourns Inc.; Power (Watts): 0.25W, 1/4W; Temperature Coefficient: ±100ppm/°C; Part Number: CRS0805-FX-1002ELF; Value: 10 kOhms; ComponentLink1Description: Datasheet; ComponentLink1URL: https://www.bourns.com/data/global/pdfs/CRS.pdf; ComponentLink2Description: DigiKey Link; ComponentLink2URL: http://digikey.com/product-detail/en/bourns-inc/CRS0805-FX-1002ELF/CRS0805-FX-1002ELFCT-ND/5778744; Composition: Thick Film; Device Package: 0805 (2012 Metric); Features: High Voltage, Pulse Withstanding; Height - Seated (Max): 0.024" (0.60mm); LastUpdated: 2.9.2020 01:14:26; Lifecycle Status: Active; Minimum Order: 1; Number of Terminations: 2; Operating Temperature: -55°C ~ 155°C; Package / Case: 0805 (2012 Metric); Packaging: TapeAndReel; PartId: 49386; Part Status: Active; Price: 0.04; Resistance: 10 kOhms; Series: CRS; Size / Dimension: 0.079" L x 0.049" W (2.00mm x 1.25mm); Supplier 1: DigiKey; Supplier Part Number 1: CRS0805-FX-1002ELFCT-ND; Supplier Device Package: 0805; Tolerance: ±1%
Y = ABM8AIG-16.000MHZ-12-2Z-T3: 16MHz Â±20ppm Crystal 12pF 70 Ohms 4-SMD, No Lead; MF: Abracon; Availability: Unavailable; Price: None; SnapEDA_Link: https://www.snapeda.com/parts/ABM8AIG-16.000MHZ-12-2Z-T3/Abracon%20LLC/view-part/454828/?ref=snap; Value: *; MP: ABM8AIG-16.000MHZ-12-2Z-T3; Package: SMD-4 Abracon

## Sheet ESP32-WROOM-32D.SchDoc
size A4
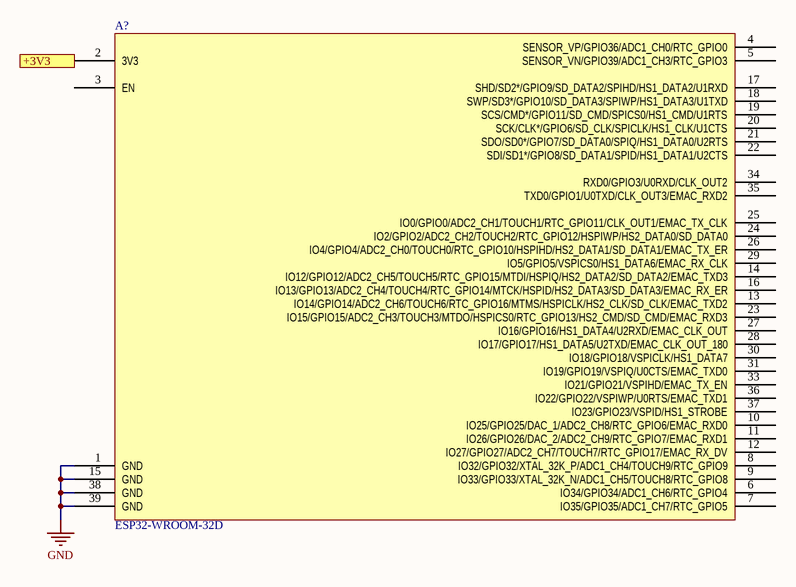
[diagram p2: ESP32-WROOM-32D.SchDoc]

### Parts
A?  ESP32-WROOM-32D  [Espressif ESP32-WROOM-32]

### Ports
+3V3

### Nets
GND: A?.1(GND) A?.15(GND) A?.38(GND) A?.39(GND)
+3V3: A?.2(3V3) ; port +3V3

Not connected (* = marked no-connect by the designer): A? 3(EN) 4(SENSOR_VP/GPIO36/ADC1_CH0/RTC_GPIO0) 5(SENSOR_VN/GPIO39/ADC1_CH3/RTC_GPIO3) 6(IO34/GPIO34/ADC1_CH6/RTC_GPIO4) 7(IO35/GPIO35/ADC1_CH7/RTC_GPIO5) 8(IO32/GPIO32/XTAL_32K_P/ADC1_CH4/TOUCH9/RTC_GPIO9) 9(IO33/GPIO33/XTAL_32K_N/ADC1_CH5/TOUCH8/RTC_GPIO8) 10(IO25/GPIO25/DAC_1/ADC2_CH8/RTC_GPIO6/EMAC_RXD0) 11(IO26/GPIO26/DAC_2/ADC2_CH9/RTC_GPIO7/EMAC_RXD1) 12(IO27/GPIO27/ADC2_CH7/TOUCH7/RTC_GPIO17/EMAC_RX_DV) 13(IO14/GPIO14/ADC2_CH6/TOUCH6/RTC_GPIO16/MTMS/HSPICLK/HS2_CLK/SD_CLK/EMAC_TXD2) 14(IO12/GPIO12/ADC2_CH5/TOUCH5/RTC_GPIO15/MTDI/HSPIQ/HS2_DATA2/SD_DATA2/EMAC_TXD3) 16(IO13/GPIO13/ADC2_CH4/TOUCH4/RTC_GPIO14/MTCK/HSPID/HS2_DATA3/SD_DATA3/EMAC_RX_ER) 17(SHD/SD2*/GPIO9/SD_DATA2/SPIHD/HS1_DATA2/U1RXD) 18(SWP/SD3*/GPIO10/SD_DATA3/SPIWP/HS1_DATA3/U1TXD) 19(SCS/CMD*/GPIO11/SD_CMD/SPICS0/HS1_CMD/U1RTS) 20(SCK/CLK*/GPIO6/SD_CLK/SPICLK/HS1_CLK/U1CTS) 21(SDO/SD0*/GPIO7/SD_DATA0/SPIQ/HS1_DATA0/U2RTS) 22(SDI/SD1*/GPIO8/SD_DATA1/SPID/HS1_DATA1/U2CTS) 23(IO15/GPIO15/ADC2_CH3/TOUCH3/MTDO/HSPICS0/RTC_GPIO13/HS2_CMD/SD_CMD/EMAC_RXD3) 24(IO2/GPIO2/ADC2_CH2/TOUCH2/RTC_GPIO12/HSPIWP/HS2_DATA0/SD_DATA0) 25(IO0/GPIO0/ADC2_CH1/TOUCH1/RTC_GPIO11/CLK_OUT1/EMAC_TX_CLK) 26(IO4/GPIO4/ADC2_CH0/TOUCH0/RTC_GPIO10/HSPIHD/HS2_DATA1/SD_DATA1/EMAC_TX_ER) 27(IO16/GPIO16/HS1_DATA4/U2RXD/EMAC_CLK_OUT) 28(IO17/GPIO17/HS1_DATA5/U2TXD/EMAC_CLK_OUT_180) 29(IO5/GPIO5/VSPICS0/HS1_DATA6/EMAC_RX_CLK) 30(IO18/GPIO18/VSPICLK/HS1_DATA7) 31(IO19/GPIO19/VSPIQ/U0CTS/EMAC_TXD0) 33(IO21/GPIO21/VSPIHD/EMAC_TX_EN) 34(RXD0/GPIO3/U0RXD/CLK_OUT2) 35(TXD0/GPIO1/U0TXD/CLK_OUT3/EMAC_RXD2) 36(IO22/GPIO22/VSPIWP/U0RTS/EMAC_TXD1) 37(IO23/GPIO23/VSPID/HS1_STROBE)

### Library data of the parts
A? = ESP32-WROOM-32D: WIFI MODULE 32MBITS SPI FLASH; Manufacturer: Espressif Systems; Utilized IC / Part: ESP32-D0WD; Antenna Type: Integrated, Trace; Data Rate: 150Mbps; Frequency: 2.4GHz ~ 2.5GHz; Memory Size: 448kB ROM, 536kB SRAM; Modulation: CCK, DSSS, OFDM; Power - Output: 20.5dBm; Protocol: 802.11b/g/n, Bluetooth v4.2 + EDR, Class 1, 2 and 3; RF Family/Standard: Bluetooth, WiFi; Sensitivity: -98dBm; Serial Interfaces: GPIO, I²C, I²S, PWM, SDIO, SPI, UART; Voltage - Supply: 2.7V ~ 3.6V; Part Number: ESP32-WROOM-32D; ComponentLink1Description: Datasheet; ComponentLink1URL: https://www.espressif.com/sites/default/files/documentation/esp32-wroom-32d_esp32-wroom-32u_datasheet_en.pdf; ComponentLink2Description: DigiKey Link; ComponentLink2URL: http://digikey.com/product-detail/en/espressif-systems/ESP32-WROOM-32D/1904-1023-1-ND/9381732; LastUpdated: 31.7.2020 15:42:37; Lifecycle Status: Active; Minimum Order: 1; Mounting Type: Surface Mount; Operating Temperature: -40°C ~ 85°C; Package / Case: 38-SMD Module; Packaging: TapeAndReel; Part Status: Active; Price: 3.80; Series: ESP32; Supplier 1: DigiKey; Supplier Part Number 1: 1904-1023-1-ND

## Nets that join several sheets
GND: charcer-wiht-stm32 (25 pins), stm side (26 pins), ESP32-WROOM-32D (A?.1 A?.15 A?.38 A?.39)
+3V3: charcer-wiht-stm32 (C?#2.2 R?#5.1 U.2), stm side (12 pins), ESP32-WROOM-32D (A?.2)
+5V: charcer-wiht-stm32 (9 pins), stm side (8 pins)